# EAGLE design boardShildSchematicBACKUP (EAGLE 6.6.0)
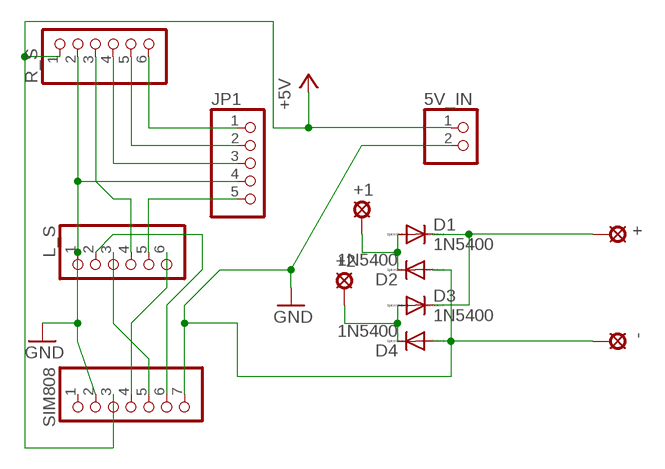
[diagram p0: schematic, sheet 1]

## Parts
5V_IN  PINHD-1X2  [1X02]
+  SE14  [SE14]
+1  SE14  [SE14]
+2  SE14  [SE14]
-  SE14  [SE14]
D1  1N5400  [DO201-15]
D2  1N5400  [DO201-15]
D3  1N5400  [DO201-15]
D4  1N5400  [DO201-15]
JP1  PINHD-1X5  [1X05]
L_S  PINHD-1X6  [1X06]
R_S  PINHD-1X6  [1X06]
SIM808  PINHD-1X7  [1X07]

## Nets
+5V: 5V_IN.1 R_S.1 SIM808.3
GND: 5V_IN.2 -.MP D2.A D4.A JP1.4 L_S.1 R_S.2 SIM808.2 SIM808.7
N$1: JP1.1 R_S.6
N$2: JP1.2 R_S.5
N$3: JP1.3 R_S.4
N$4: L_S.4 R_S.3
N$5: L_S.2 SIM808.6
N$6: JP1.5 L_S.5
N$8: L_S.3 SIM808.5
N$9: L_S.6 SIM808.4
N$12: +1.MP D1.A D2.C
N$13: +2.MP D3.A D4.C
N$15: +.MP D1.C D3.C
Unconnected: SIM808.1

## Library data of the parts
5V_IN = pinhead:PINHD-1X2: PIN HEADER
+ +1 +2 - = solpad:SE14: SOLDER PAD E1553, drill 1,4mm, distributor Buerklin, 07F820
D1-D4 = diode:1N5400: DIODE standard rectifier, 3 A, 50 V (Motorola)
JP1 = pinhead:PINHD-1X5: PIN HEADER
L_S R_S = pinhead:PINHD-1X6: PIN HEADER
SIM808 = pinhead:PINHD-1X7: PIN HEADER

## Board
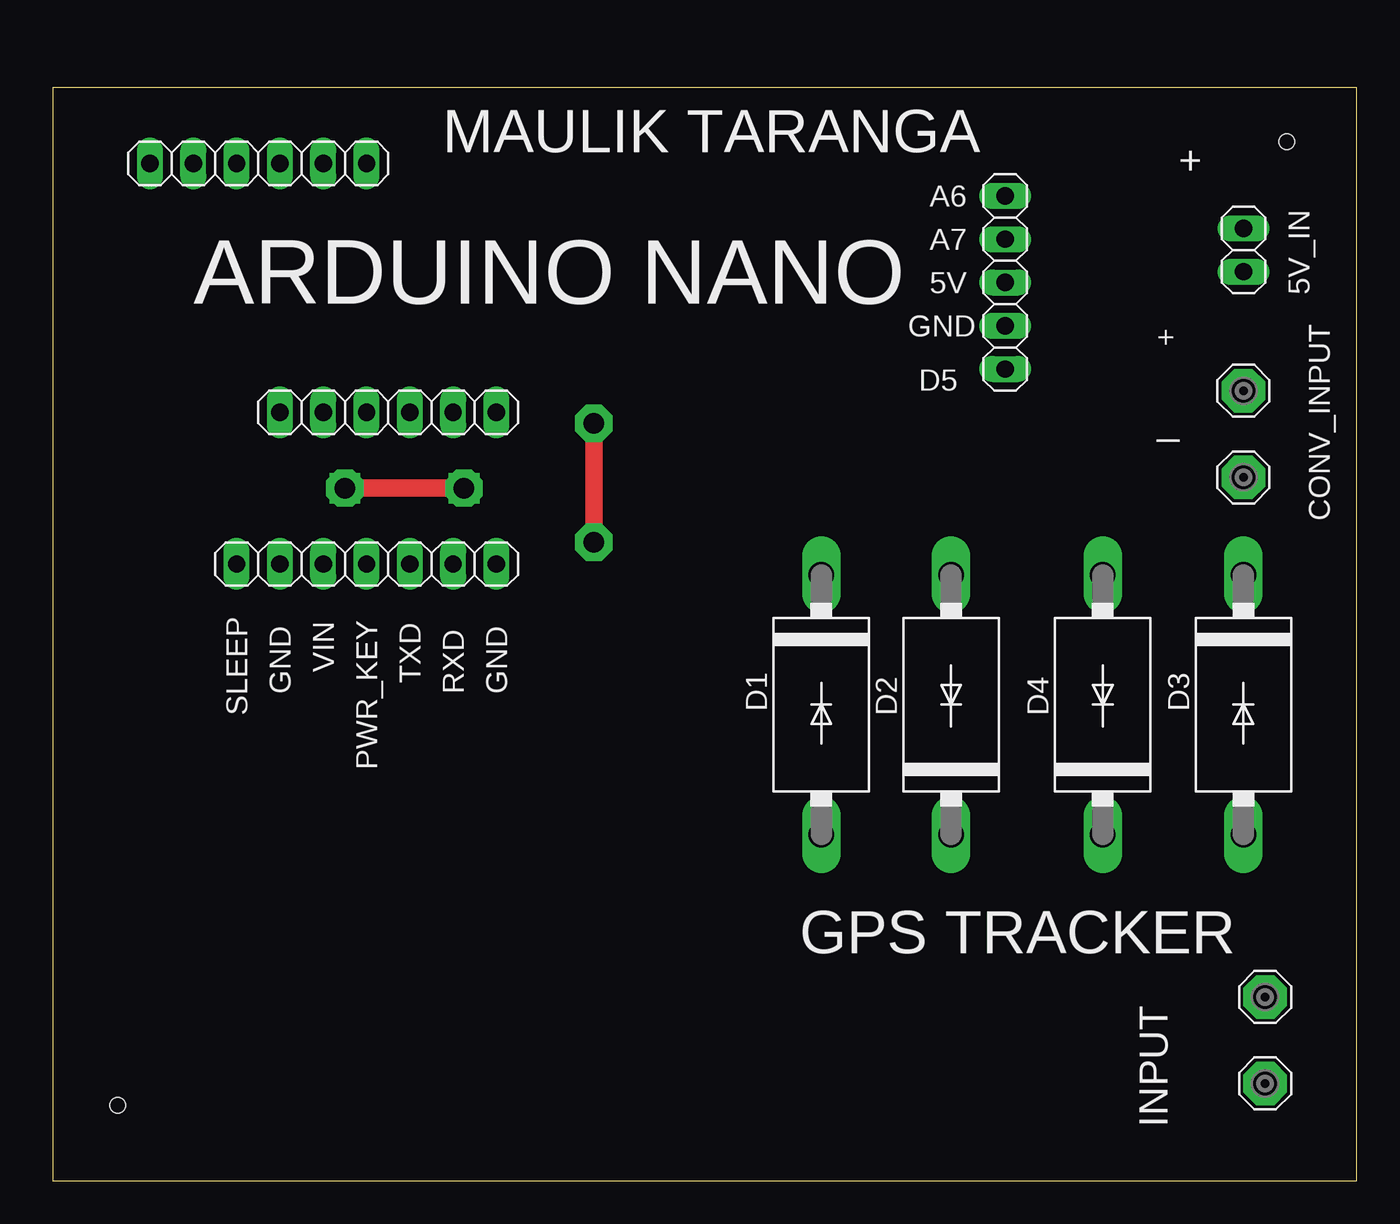
[diagram p1: board, top side]
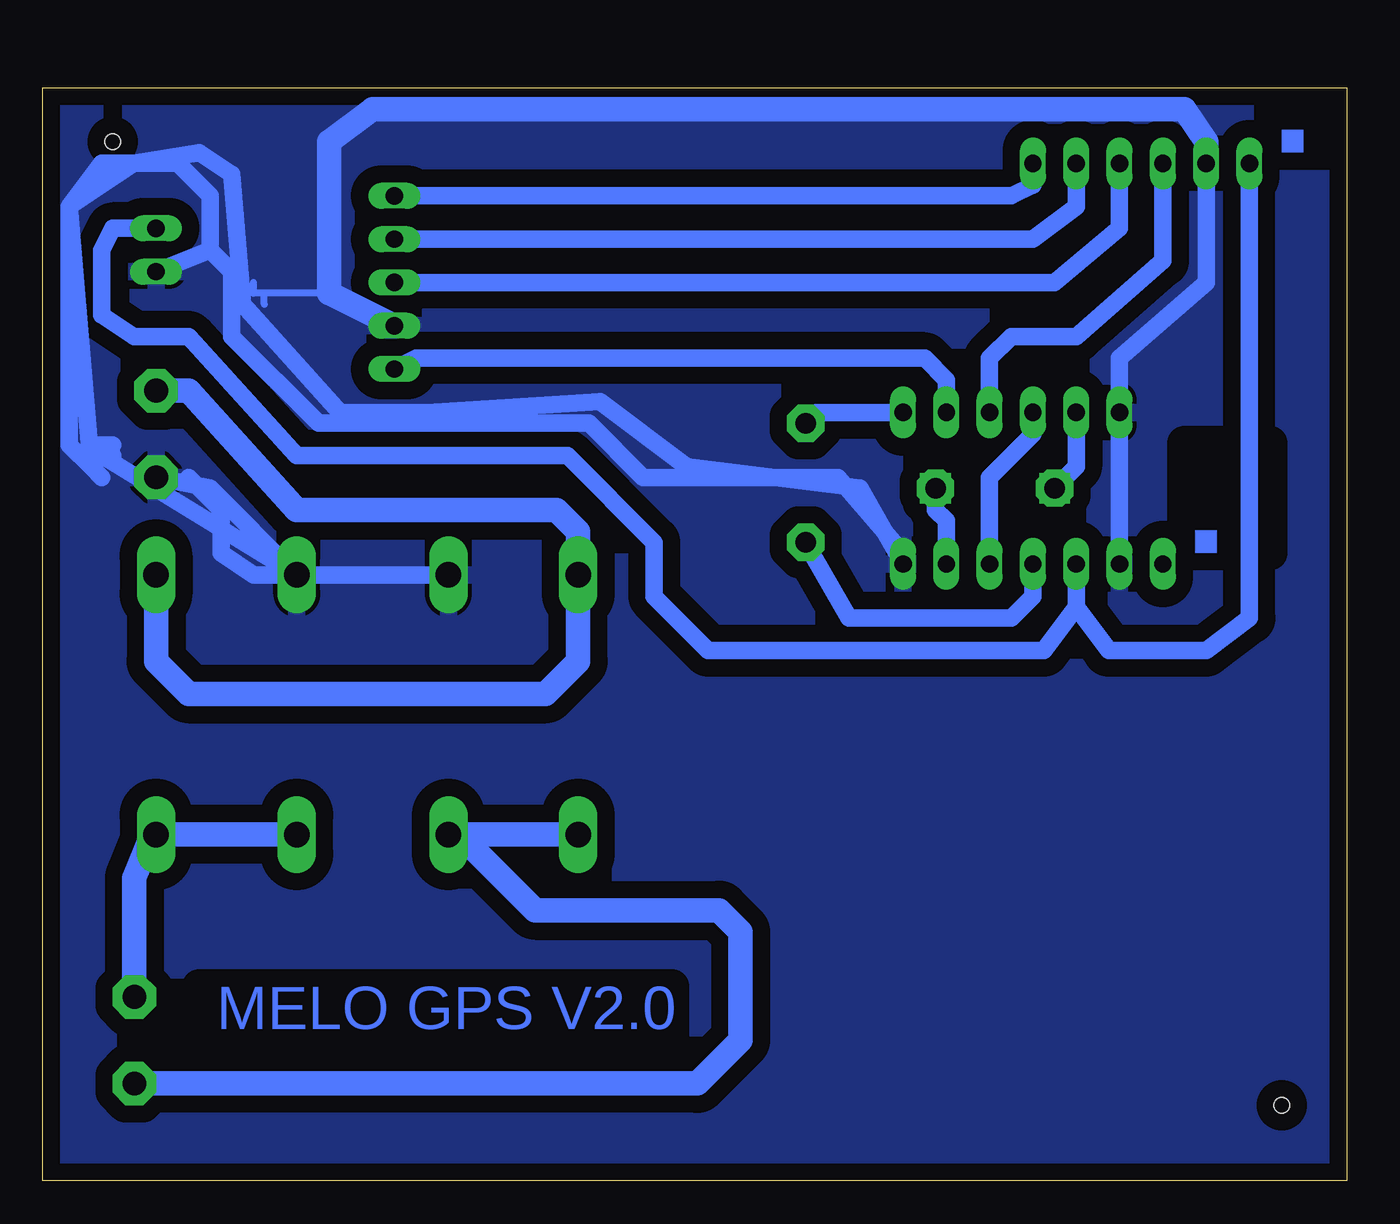
[diagram p2: board, bottom side, seen from below]

Size 76.5 x 64.12 mm. Coordinates in mm from the lower left corner, seen from the top.
Outline: 0,0 76.5,0 76.5,64.12 0,64.12 0,0
Copper layers (1*16): Top 0.035mm / dielectric 1.5mm / Bottom 0.035mm
Design rules "default *": minimum track width 10mil, minimum drill 24mil, track to track 40mil, track to pad 25mil, pad to pad 8mil, via to via 8mil, smd to smd 8mil, copper to edge 40mil, drill to drill 8mil, minimum pad ring 10mil, minimum via ring 8mil, stop-mask expansion 4mil, vias tented up to drill 0mil, thermal gap 10mil
Holes 0.9 mm at 72.39,60.96 3.81,4.45

### Footprints (pad centres in the part's own frame; a part is rotated, then mirrored left to right if it is on the bottom)
1X02 = drill 1.016 long: 1 -1.27,0; 2 1.27,0
SE14 = drill 1.397 pad 2.54 octagon: MP 0,0
DO201-15 = drill 1.499 long: A 7.62,0; C -7.62,0
1X05 = drill 1.016 long: 1 -5.08,0; 2 -2.54,0; 3 0,0; 4 2.54,0; 5 5.08,0
1X06 = drill 1.016 long: 1 -6.35,0; 2 -3.81,0; 3 -1.27,0; 4 1.27,0; 5 3.81,0; 6 6.35,0
1X07 = drill 1.016 long: 1 -7.62,0; 2 -5.08,0; 3 -2.54,0; 4 0,0; 5 2.54,0; 6 5.08,0; 7 7.62,0

### Placement (x,y rotation side)
5V_IN  69.85,54.61 270 top
+  69.85,46.36 0 top
+1  71.12,5.71 0 top
+2  71.12,10.8 0 top
-  69.85,41.28 0 top
D1  45.08,27.94 270 top
D2  52.7,27.94 90 top
D3  69.85,27.94 270 top
D4  61.59,27.94 90 top
JP1  55.88,52.7 270 top
L_S  19.68,45.08 0 top
R_S  12.07,59.69 0 top
SIM808  18.42,36.2 0 top

### Tracks (layer width: path | path; a pad name or v marks a point on that pad's centre or on a via)
+5V
  Bottom 1.016: 15.88,35.56 SIM808.3 15.88,33.66 | 15.88,33.66 13.97,31.11 8.26,31.11 5.71,33.02 R_S.1 | 5V_IN.1 72.39,55.88 73.02,54.61 73.02,50.8 71.12,49.53 67.94,49.53 61.59,42.55 45.72,42.55 40.64,37.47 40.64,34.29 37.47,31.11 17.78,31.11 15.88,33.66
GND
  Bottom 0.406: 59.69,52.07 63.5,52.07 | 63.5,51.44 63.5,52.07 | 63.5,52.07 64.13,52.07 64.13,52.7
  Bottom 1.016: 66.67,54.61 65.41,53.34 65.41,49.53 60.33,44.45 44.45,44.45 41.28,41.28 29.85,41.28 26.04,36.83 SIM808.7 28.57,40.64 38.73,41.91 43.81,45.72 53.97,45.08 59.05,45.08 64.77,51.44 65.41,59.06 67.31,60.33 71.12,59.69 | 66.67,54.61 5V_IN.2 | D2.A D4.A | D4.A 64.13,35.56 66.04,36.83 66.04,39.37 67.94,41.28 | 73.02,41.28 73.66,41.91 | 73.66,41.91 74.93,43.18 74.93,57.15 | 74.93,57.15 73.02,59.69 71.12,59.69 | 71.12,59.69 68.58,59.69 66.67,57.79 66.67,54.61 | -.MP 66.67,40.64 D4.A | D4.A 73.02,42.55 73.02,43.18 | 71.12,59.69 74.93,57.15 | 74.93,57.15 73.66,41.91 | 73.66,41.91 72.39,43.18 73.02,43.18 | 73.02,43.18 73.66,43.18 72.39,42.55 73.02,43.18 | R_S.2 8.26,52.7 13.34,48.26 L_S.1 SIM808.2
  Bottom 1.422: R_S.2 8.26,60.96 9.53,62.87 57.15,62.87 59.69,60.96 59.69,52.07 JP1.4
  pour Bottom: -0.63,66.04 0,-0.63 76.2,0 76.83,66.04
N$1
  Bottom 1.016: R_S.6 18.42,58.42 19.68,57.79 JP1.1
N$2
  Bottom 1.016: R_S.5 15.88,57.15 18.42,55.25 JP1.2
N$3
  Bottom 1.016: R_S.4 13.34,55.88 17.14,52.7 JP1.3
N$4
  Bottom 1.016: R_S.3 10.8,53.98 15.88,49.53 19.68,49.53 20.96,48.26 L_S.4
N$5  (via drill 0.7 pad 0.25, 1.2 pad 0.61, 1.2 pad 2.18)
  Top 1.016: v17.14,40.64 v24.13,40.64
  Bottom 1.016: L_S.2 15.88,41.91 v17.14,40.64 | v24.13,40.64 24.13,39.37 23.5,38.73 SIM808.6
N$6
  Bottom 1.016: L_S.5 23.5,46.99 24.77,48.26 54.61,48.26 JP1.5
N$8
  Bottom 1.016: L_S.3 18.42,43.81 20.96,41.28 SIM808.5
N$9  (via drill 0.7 pad 0.25, 1.2 pad 2.18)
  Top 1.016: v31.75,37.47 v31.75,44.45 v31.75,37.47
  Bottom 1.016: SIM808.4 18.42,34.29 19.68,33.02 29.21,33.02 | 29.21,33.02 v31.75,37.47 | v31.75,44.45 31.11,45.08 L_S.6 | 29.21,33.02 v31.75,37.47 | 29.21,33.02 v31.75,37.47 | 29.21,33.02 v31.75,37.47
N$12
  Bottom 1.27: D2.C 52.07,20.32
  Bottom 1.422: D1.A D2.C | 52.07,20.32 47.62,15.88 36.83,15.88 35.56,14.61 35.56,8.25 38.1,5.71 +1.MP
N$13
  Bottom 1.422: D4.C D3.A 69.85,20.96 71.12,17.78 +2.MP
N$15
  Bottom 1.422: D3.C 69.85,30.48 67.94,28.57 46.99,28.57 45.08,30.48 D1.C 45.08,38.1 46.36,39.37 61.59,39.37 67.94,46.36 +.MP

### Text on the board
Bottom: . | . | MELO GPS V2.0
tNames: MAULIK TARANGA | + | A6 | A7 | ARDUINO NANO | 5V | GND | + | D5 | _ | CONV_INPUT | VIN | GND | TXD | RXD | GND | SLEEP | PWR_KEY | GPS TRACKER | INPUT